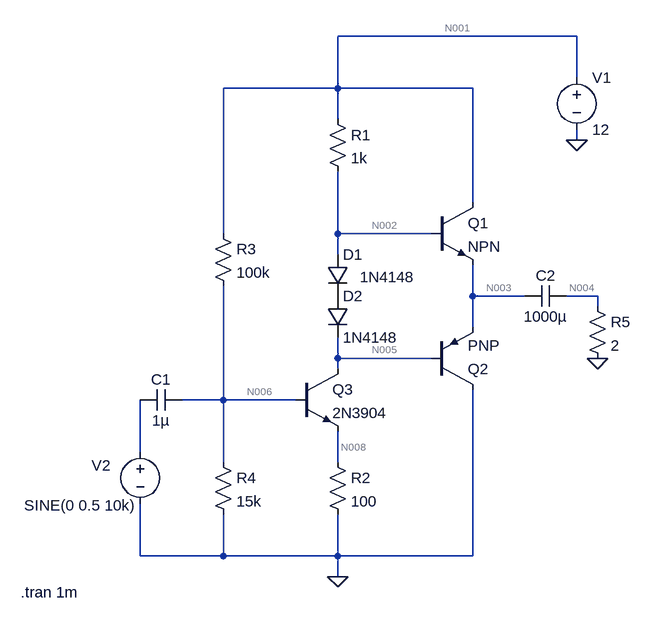
[diagram p0: schematic Last weekend try2.asc]
Last weekend try2.asc, the LTspice schematic file:
Version 4
SHEET 1 880 680
WIRE 448 -336 80 -336
WIRE 448 -272 448 -336
WIRE 80 -256 80 -336
WIRE 80 -256 -96 -256
WIRE 288 -256 80 -256
WIRE 80 -208 80 -256
WIRE 448 -176 448 -192
WIRE 288 -80 288 -256
WIRE -96 -32 -96 -256
WIRE 80 -32 80 -128
WIRE 224 -32 80 -32
WIRE 80 0 80 -32
WIRE 288 64 288 16
WIRE 368 64 288 64
WIRE 480 64 432 64
WIRE 480 80 480 64
WIRE 288 112 288 64
WIRE 80 160 80 128
WIRE 224 160 80 160
WIRE 80 176 80 160
WIRE -96 224 -96 48
WIRE -96 224 -160 224
WIRE 16 224 -96 224
WIRE -224 304 -224 224
WIRE -96 320 -96 224
WIRE 80 320 80 272
WIRE -224 464 -224 384
WIRE -96 464 -96 400
WIRE -96 464 -224 464
WIRE 80 464 80 400
WIRE 80 464 -96 464
WIRE 288 464 288 208
WIRE 288 464 80 464
WIRE 80 496 80 464
FLAG 480 160 0
FLAG 448 -176 0
FLAG 80 496 0
SYMBOL npn 16 176 R0
SYMATTR InstName Q3
SYMATTR Value 2N3904
SYMBOL diode 64 0 R0
WINDOW 3 50 35 Left 2
SYMATTR Value 1N4148
SYMATTR InstName D1
SYMBOL diode 64 64 R0
SYMATTR InstName D2
SYMATTR Value 1N4148
SYMBOL res 64 -224 R0
SYMATTR InstName R1
SYMATTR Value 1k
SYMBOL res 64 304 R0
SYMATTR InstName R2
SYMATTR Value 100
SYMBOL res -112 -48 R0
SYMATTR InstName R3
SYMATTR Value 100k
SYMBOL res -112 304 R0
SYMATTR InstName R4
SYMATTR Value 15k
SYMBOL cap -160 208 R90
WINDOW 0 0 32 VBottom 2
WINDOW 3 32 32 VTop 2
SYMATTR InstName C1
SYMATTR Value 1µ
SYMBOL res 464 64 R0
SYMATTR InstName R5
SYMATTR Value 2
SYMBOL voltage 448 -288 R0
WINDOW 123 0 0 Left 0
WINDOW 39 0 0 Left 0
SYMATTR InstName V1
SYMATTR Value 12
SYMBOL voltage -224 288 R0
WINDOW 0 -75 37 Left 2
WINDOW 3 -179 98 Left 2
WINDOW 123 0 0 Left 0
WINDOW 39 0 0 Left 0
SYMATTR InstName V2
SYMATTR Value SINE(0 0.5 10k)
SYMBOL cap 432 48 R90
WINDOW 0 0 32 VBottom 2
WINDOW 3 32 32 VTop 2
SYMATTR InstName C2
SYMATTR Value 1000µ
SYMBOL npn 224 -80 R0
SYMATTR InstName Q1
SYMBOL pnp 224 208 M180
SYMATTR InstName Q2
TEXT -408 520 Left 2 !.tran 1m

The netlist it stands for:
* Last weekend try2.asc
Q3 N005 N006 N008 0 2N3904
D1 N002 P001 1N4148
D2 P001 N005 1N4148
R1 N001 N002 1k
R2 N008 0 100
R3 N001 N006 100k
R4 N006 0 15k
C1 N006 N007 1µ
R5 N004 0 2
V1 N001 0 12
V2 N007 0 SINE(0 0.5 10k)
C2 N004 N003 1000µ
Q1 N001 N002 N003 0 NPN
Q2 0 N005 N003 0 PNP
.model D D
.lib standard.dio
.model NPN NPN
.model PNP PNP
.lib standard.bjt
.tran 1m
.backanno
.end

* Results of the author's LTspice run, read from the files saved beside the schematic
* Operating Point, zero values left out:
*   V(n005) = 4.627 V
*   V(n006) = 1.308 V
*   V(n008) = 605.4 mV
*   V(n002) = 5.965 V
*   V(p001) = 5.296 V
*   V(n001) = 12 V
*   V(n003) = 5.296 V
*   Ic(Q2) = -17.14 µA
*   Ib(Q2) = -171.4 nA
*   Ie(Q2) = 17.31 µA
*   Ic(Q1) = 17.14 µA
*   Ib(Q1) = 171.4 nA
*   Ie(Q1) = -17.31 µA
*   Ic(Q3) = 6.035 mA
*   Ib(Q3) = 19.75 µA
*   Ie(Q3) = -6.054 mA
*   I(D2) = 6.034 mA
*   I(D1) = 6.034 mA
*   I(R4) = 87.17 µA
*   I(R3) = 106.9 µA
*   I(R2) = 6.054 mA
*   I(R1) = 6.035 mA
*   I(V1) = -6.159 mA
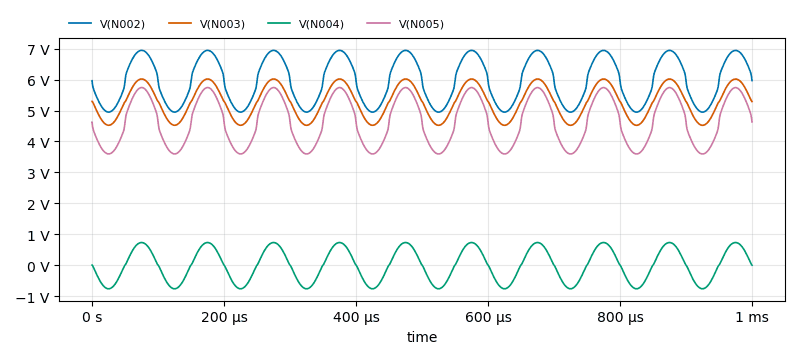
[diagram p1: Transient Analysis of Last weekend try2.asc, plotted from the saved traces]
* Transient Analysis, 1 run:
*   V(N002): min 4.949 V, max 6.948 V, average 5.957 V, rms 6.004 V, last 5.97 V
*   V(N003): min 4.524 V, max 6.021 V, average 5.283 V, rms 5.309 V, last 5.293 V
*   V(N004): min -765.2 mV, max 732 mV, average -6.246 mV, rms 524.4 mV, last 19.87 µV
*   V(N005): min 3.596 V, max 5.745 V, average 4.651 V, rms 4.718 V, last 4.632 V